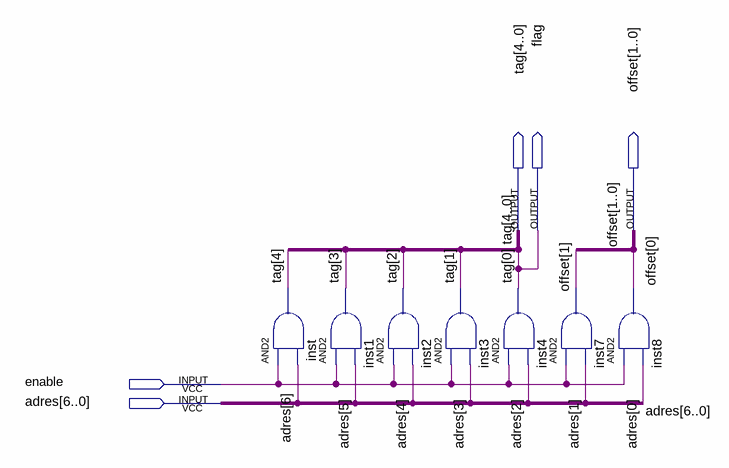
[diagram p0: schematic sheet]
// Quartus schematic adresDecoder.bdf as structural Verilog: 7 symbols, 5 pins
module adresDecoder (
  input  enable,
  input  [6:0] adres,
  output [4:0] tag,
  output flag,
  output [1:0] offset
);

  and inst (tag[4], enable, adres[6]);
  and inst1 (tag[3], enable, adres[5]);
  and inst2 (tag[2], enable, adres[4]);
  and inst3 (tag[1], enable, adres[3]);
  and inst4 (flag, enable, adres[2]);
  and inst7 (offset[1], enable, adres[1]);
  and inst8 (offset[0], enable, adres[0]);

  assign tag[0] = flag;
endmodule
